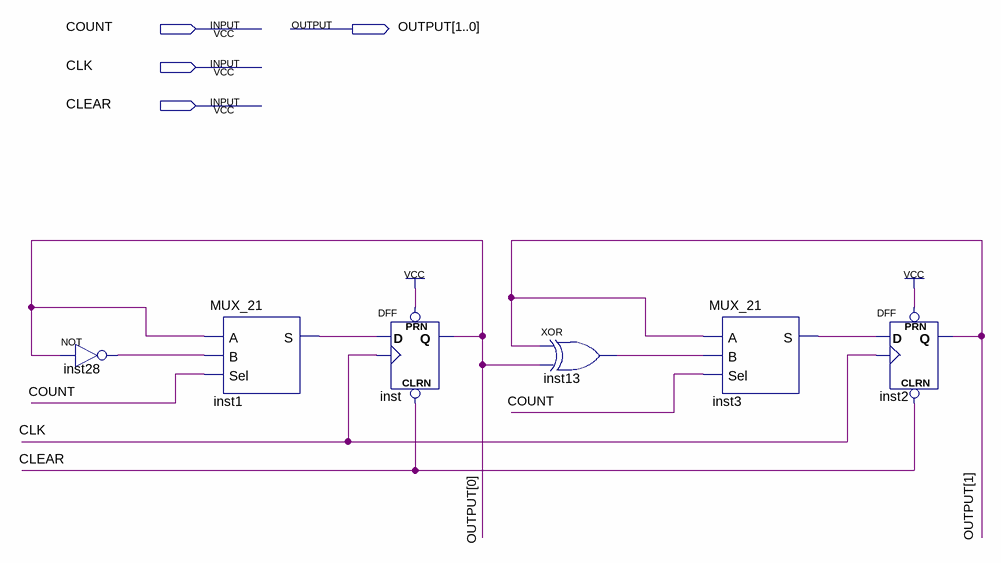
[diagram p0: schematic sheet]
// Quartus schematic TWO_SEC_TIMER.bdf as structural Verilog: 6 symbols, 4 pins
module TWO_SEC_TIMER (
  input  COUNT,
  input  CLK,
  input  CLEAR,
  output [1:0] OUTPUT
);

  wire inst1_s, inst3_s, inst13_out, inst28_out;

  not inst28 (inst28_out, OUTPUT[0]);
  MUX_21 inst1 (.A(OUTPUT[0]), .B(inst28_out), .Sel(COUNT), .S(inst1_s));
  DFF inst (.CLRN(CLEAR), .CLK(CLK), .D(inst1_s), .PRN(1'b1), .Q(OUTPUT[0]));
  xor inst13 (inst13_out, OUTPUT[1], OUTPUT[0]);
  MUX_21 inst3 (.A(OUTPUT[1]), .B(inst13_out), .Sel(COUNT), .S(inst3_s));
  DFF inst2 (.CLRN(CLEAR), .CLK(CLK), .D(inst3_s), .PRN(1'b1), .Q(OUTPUT[1]));
endmodule
